# Altium project Uno_to_Connector.PrjPcb
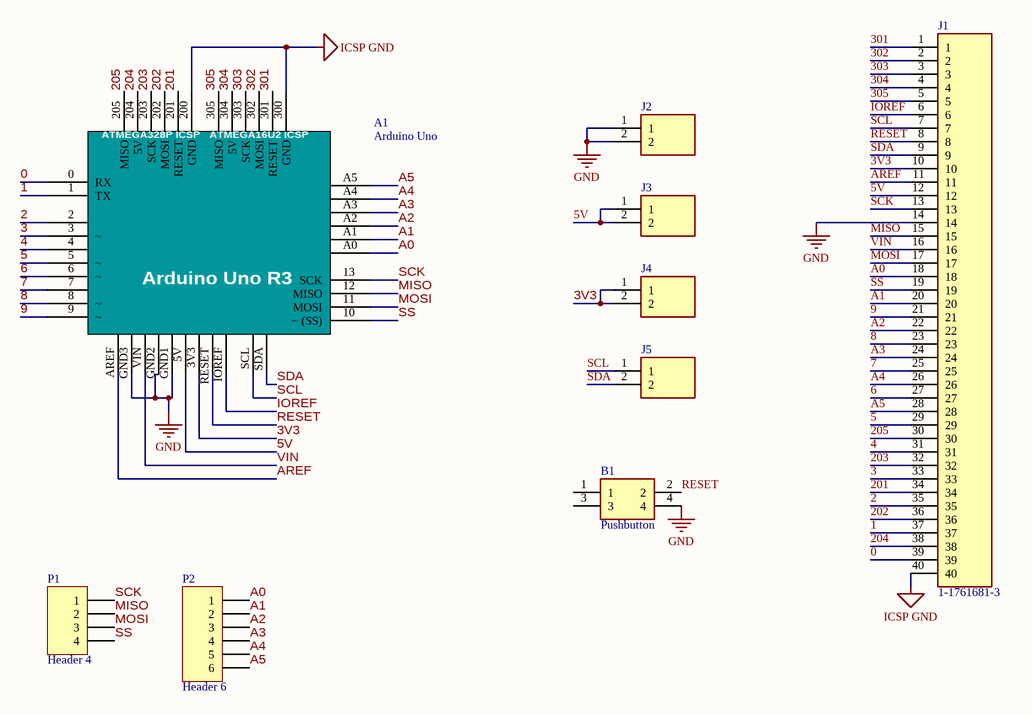
[diagram p0: Main.SchDoc]
1 sheet, 9 parts. Net scope: global (net labels, ports and power ports of the same name join across sheets).
Board file: Main.PcbDoc

## Sheet Main.SchDoc
size A; SheetNumber: 1; SheetTotal: 1

### Parts
A1  Arduino Uno  [Arduino Uno]
B1  Pushbutton  [FSM4JH]
J1  1-1761681-3  [TE_1-1761681-3]
J2  TB002-500-02BE  [TB00250002BE]  (value not drawn)
J3  TB002-500-02BE  [TB00250002BE]  (value not drawn)
J4  TB002-500-02BE  [TB00250002BE]  (value not drawn)
J5  TB002-500-02BE  [TB00250002BE]  (value not drawn)
P1  Header 4  [HDR1X4]
P2  Header 6  [HDR1X6]

### Nets
GND: A1.GND1 A1.GND2 A1.GND3 B1.4 J1.14 J2.1 J2.2
ICSP GND: A1.200(GND) A1.300(GND) J1.40
0: A1.0(RX) J1.39
1: A1.1(TX) J1.37
2: A1.2 J1.35
3: A1.3 J1.33
3V3: A1.3V3 J1.10 J4.1 J4.2
4: A1.4 J1.31
5: A1.5 J1.29
5V: A1.5V J1.12 J3.1 J3.2
6: A1.6 J1.27
7: A1.7 J1.25
8: A1.8 J1.23
9: A1.9 J1.21
201: A1.201(RESET) J1.34
202: A1.202(MOSI) J1.36
203: A1.203(SCK) J1.32
204: A1.204(5V) J1.38
205: A1.205(MISO) J1.30
301: A1.301(RESET) J1.1
302: A1.302(MOSI) J1.2
303: A1.303(SCK) J1.3
304: A1.304(5V) J1.4
305: A1.305(MISO) J1.5
A0: A1.A0 J1.18 P2.1
A1: A1.A1 J1.20 P2.2
A2: A1.A2 J1.22 P2.3
A3: A1.A3 J1.24 P2.4
A4: A1.A4 J1.26 P2.5
A5: A1.A5 J1.28 P2.6
AREF: A1.AREF J1.11
IOREF: A1.IOREF J1.6
MISO: A1.12(MISO) J1.15 P1.2
MOSI: A1.11(MOSI) J1.17 P1.3
RESET: A1.RESET B1.2 J1.8
SCK: A1.13(SCK) J1.13 P1.1
SCL: A1.SCL J1.7 J5.1
SDA: A1.SDA J1.9 J5.2
SS: A1.10(~_(SS)) J1.19 P1.4
VIN: A1.VIN J1.16

Not connected (* = marked no-connect by the designer): B1 1 3

### Notes on the sheet
- (in symbol Arduino Uno) ATMEGA328P ICSP; ATMEGA16U2 ICSP; Arduino Uno R3

### Library data of the parts
B1 = Pushbutton: Switch; Manufacturer_Name: TE Connectivity; Manufacturer_Part_Number: FSM2JAH; Datasheet Link: http://www.te.com/commerce/DocumentDelivery/DDEController?Action=showdoc&DocId=Customer+Drawing%7F1825910%7FC9%7Fpdf%7FEnglish%7FENG_CD_1825910_C9.pdf%7F1825910-3; Mouser Part Number: 506-FSM2JAH; Mouser Price/Stock: https://www.mouser.co.uk/ProductDetail/TE-Connectivity-PB/FSM2JAH?qs=Of7OaoM7rsH02ckr%252BGLHNA%3D%3D
J1 = 1-1761681-3: IDC LOW PRO HDR 50P VERT HT BLACK; Package: None; Price: None; Value: *; MP: 1-1761681-3; Availability: Unavailable
J2-J5 = TB002-500-02BE: Connector; Manufacturer_Name: CUI Devices; Datasheet Link: https://eu.mouser.com/datasheet/2/670/tb002_500-1550579.pdf; Height: 10.4mm; Manufacturer_Part_Number: TB002-500-02BE; Mouser Part Number: 490-TB002-500-02BE; Mouser Price/Stock: https://www.mouser.co.uk/ProductDetail/CUI-Devices/TB002-500-02BE?qs=vLWxofP3U2x9716kcgva%2Fw%3D%3D; Arrow Part Number: TB002-500-02BE; Arrow Price/Stock: https://www.arrow.com/en/products/tb002-500-02be/cui-devices?region=nac
P1 = Header 4: Header, 4-Pin; LatestRevisionDate: 17-Jul-2002; LatestRevisionNote: Re-released for DXP Platform.; Publisher: Altium Limited
P2 = Header 6: Header, 6-Pin; LatestRevisionDate: 17-Jul-2002; LatestRevisionNote: Re-released for DXP Platform.; Publisher: Altium Limited